# EAGLE design avr_board (EAGLE 9.6.2)
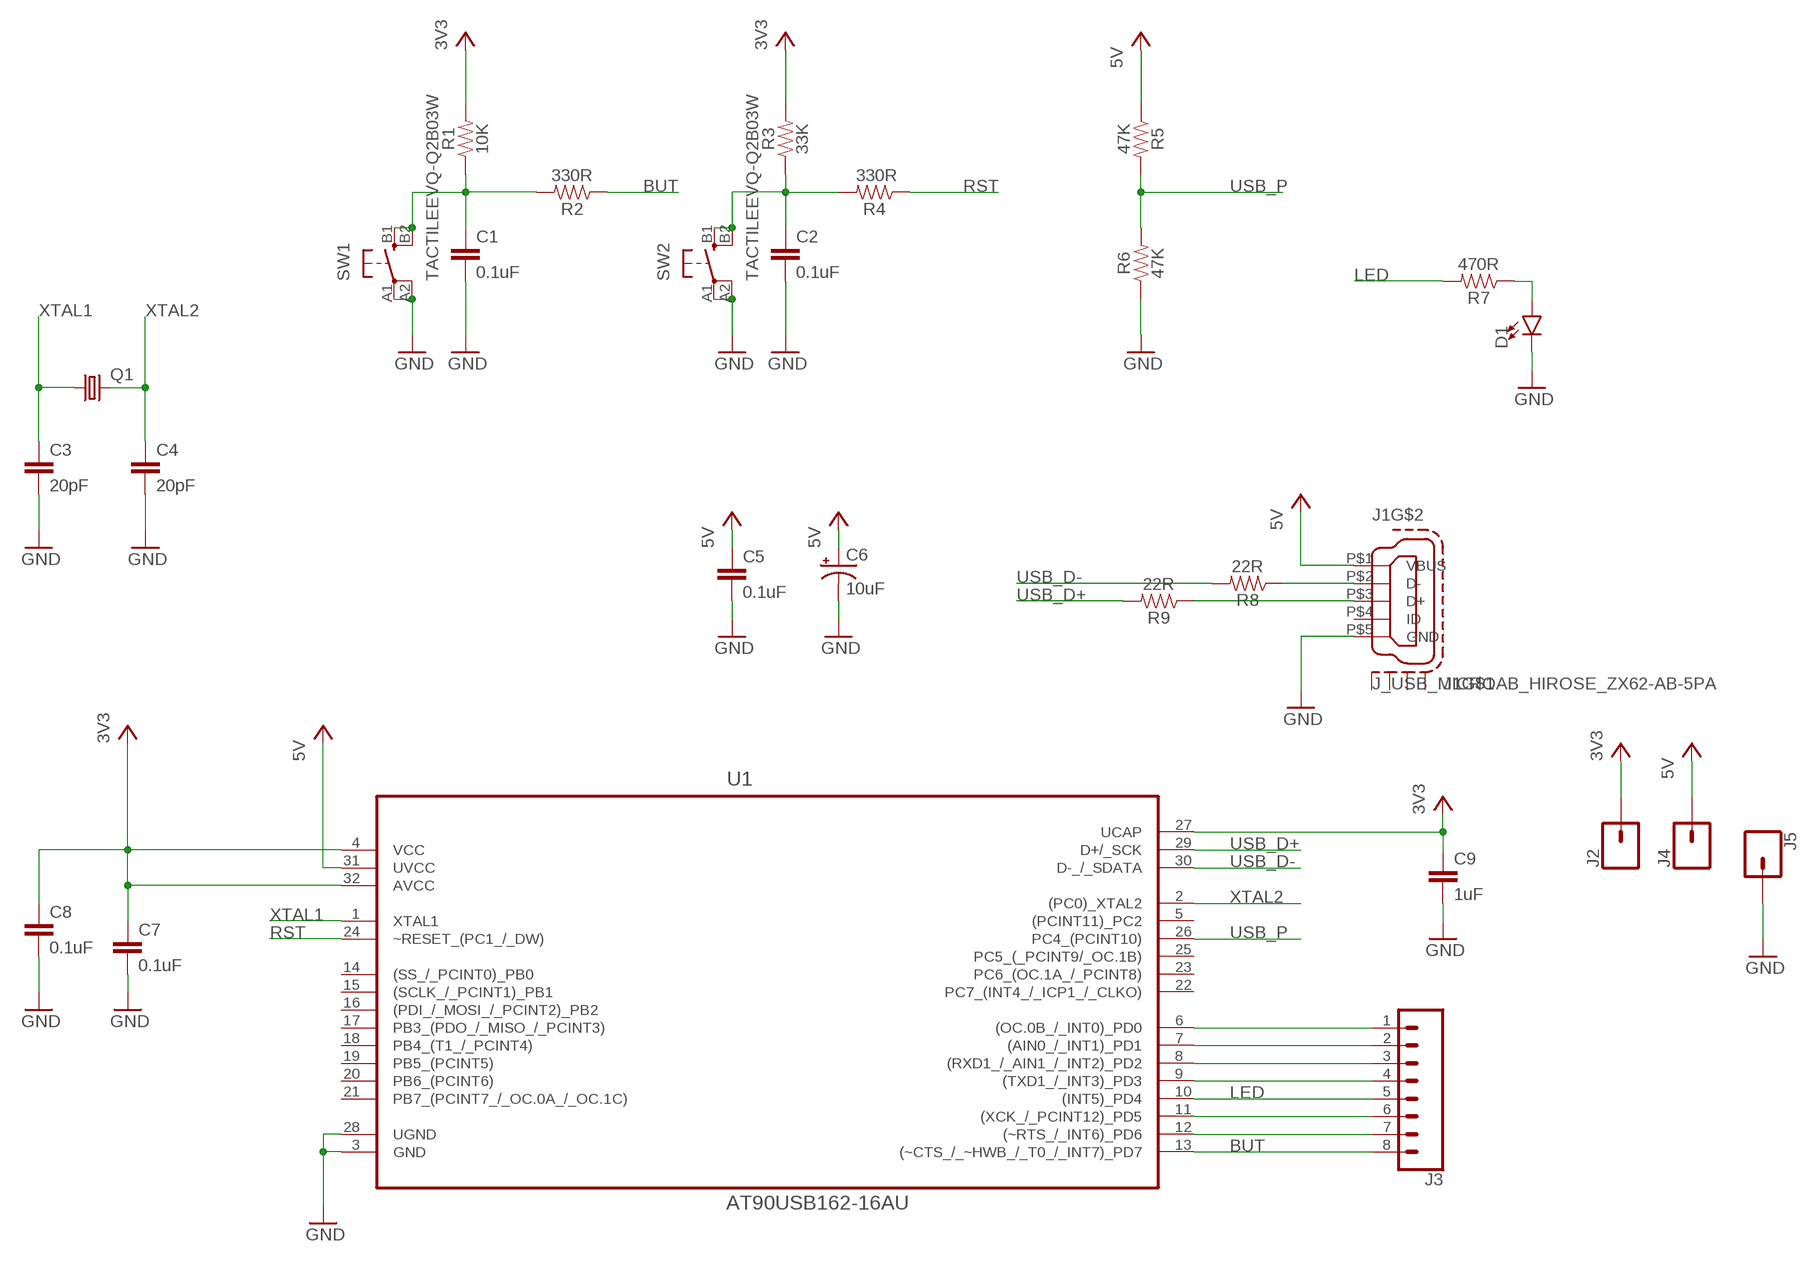
[diagram p0: schematic, sheet 1]

## Parts
C1  0.1uF  0.1UF-0603-25V-(+80/-20%)  [0603]
C2  0.1uF  0.1UF-0603-25V-(+80/-20%)  [0603]
C3  20pF  0.1UF-0603-25V-(+80/-20%)  [0603]
C4  20pF  0.1UF-0603-25V-(+80/-20%)  [0603]
C5  0.1uF  0.1UF-0603-25V-(+80/-20%)  [0603]
C6  10uF  10UF-TANT  [EIA3216]
C7  0.1uF  0.1UF-0603-25V-(+80/-20%)  [0603]
C8  0.1uF  0.1UF-0603-25V-(+80/-20%)  [0603]
C9  1uF  0.1UF-0603-25V-(+80/-20%)  [0603]
D1  LEDPLCC  [PLCC-2]
J1  J_USB_MICROAB_HIROSE_ZX62-AB-5PA  [J_USB_MICROAB_HIROSE_ZX62-AB-5PA]
J2  CONN_01  [1X01]
J3  CONN_08"  [1X08]
J4  CONN_01  [1X01]
J5  CONN_01  [1X01]
Q1  CRYSTALCTS406  [CTS406]
R1  10K  RESISTOR0603  [0603]
R2  330R  RESISTOR0603  [0603]
R3  33K  RESISTOR0603  [0603]
R4  330R  RESISTOR0603  [0603]
R5  47K  RESISTOR0603  [0603]
R6  47K  RESISTOR0603  [0603]
R7  470R  RESISTOR0603  [0603]
R8  22R  RESISTOR0603  [0603]
R9  22R  RESISTOR0603  [0603]
SW1  TACTILEEVQ-Q2B03W  [TACTILE_PAC]
SW2  TACTILEEVQ-Q2B03W  [TACTILE_PAC]
U1  AT90USB162-16AU  [QFP80P900X900X120-32N]

## Nets
+5V: C5.1 C6.A(+) J1.P$1(VBUS) J4.1 R5.1 U1.31(UVCC) ; supply symbol labelled 5V
BUT: J3.8 R2.1 U1.13((~CTS_/_~HWB_/_T0_/_INT7)_PD7)
GND: C1.2 C2.2 C3.2 C4.2 C5.2 C6.C(-) C7.2 C8.2 C9.2 D1.C J1.P$5(GND) J5.1 R6.1 SW1.A1 SW1.A2 SW2.A1 SW2.A2 U1.3(GND) U1.28(UGND)
LED: J3.5 R7.2 U1.10((INT5)_PD4)
N$1: C1.1 R1.1 R2.2 SW1.B1 SW1.B2
N$2: D1.A R7.1
N$3: C2.1 R3.1 R4.2 SW2.B1 SW2.B2
N$4: J3.7 U1.12((~RTS_/_INT6)_PD6)
N$5: J1.P$2(D-) R8.1
N$6: J1.P$3(D+) R9.1
N$7: J3.6 U1.11((XCK_/_PCINT12)_PD5)
N$9: J3.4 U1.9((TXD1_/_INT3)_PD3)
N$10: J3.3 U1.8((RXD1_/_AIN1_/_INT2)_PD2)
N$11: J3.2 U1.7((AIN0_/_INT1)_PD1)
N$12: J3.1 U1.6((OC.0B_/_INT0)_PD0)
RST: R4.1 U1.24(~RESET_(PC1_/_DW))
USB_D+: R9.2 U1.29(D+/_SCK)
USB_D-: R8.2 U1.30(D-_/_SDATA)
USB_P: R5.2 R6.2 U1.26(PC4_(PCINT10))
VCC: C7.1 C8.1 C9.1 J2.1 R1.2 R3.2 U1.4(VCC) U1.27(UCAP) U1.32(AVCC) ; supply symbol labelled 3V3
XTAL1: C3.1 Q1.1 U1.1(XTAL1)
XTAL2: C4.1 Q1.3 U1.2((PC0)_XTAL2)
Unconnected: J1.P$4(ID) J1.SHIELD1(S1) J1.SHIELD2(S2) J1.SHIELD3(S3) J1.SHIELD4(S4) U1.5((PCINT11)_PC2) U1.14((SS_/_PCINT0)_PB0) U1.15((SCLK_/_PCINT1)_PB1) U1.16((PDI_/_MOSI_/_PCINT2)_PB2) U1.17(PB3_(PDO_/_MISO_/_PCINT3)) U1.18(PB4_(T1_/_PCINT4)) U1.19(PB5_(PCINT5)) U1.20(PB6_(PCINT6)) U1.21(PB7_(PCINT7_/_OC.0A_/_OC.1C)) U1.22(PC7_(INT4_/_ICP1_/_CLKO)) U1.23(PC6_(OC.1A_/_PCINT8)) U1.25(PC5_(_PCINT9/_OC.1B))

## Library data of the parts
C1 C2 C5 C7 C8 = SparkFun-Capacitors:0.1UF: 0.1µF ceramic capacitors A capacitor is a passive two-terminal electrical component used to store electrical energy temporarily in an electric field.; PROD_ID: CAP-00810
C3 C4 C9 = SparkFun-Capacitors:0.1UF: 0.1µF ceramic capacitors A capacitor is a passive two-terminal electrical component used to store electrical energy temporarily in an electric field.; PROD_ID: CAP-00810; VALUE: 0.1uF
C6 = SparkFun-Retired:10UF-TANT: 10uF Tantalum SMT CAP-00811- 16V 10% (EIA-3216); PROD_ID: CAP-00811
D1 = SparkFun-LED:LED: LED (Generic) Standard schematic elements and footprints for 5mm, 3mm, 1206, and 0603 sized LEDs. Generic LEDs with no color specified.
J1 = j_usb_hirose_zx62-ab-5pa:J_USB_MICROAB_HIROSE_ZX62-AB-5PA: USB Micro-AB SMT connector Hirose Electric Co Ltd: ZX62-AB-5P
J2 J4 J5 = SparkFun-Connectors:CONN_01: Single connection point. Often used as Generic Header-pin footprint for 0.1 inch spaced/style header connections On any of the 0.1 inch spaced packages, you can populate with these: Break Away Headers - Straight <https://www.sparkfun.com/products/116> (PRT-00116) Break Away Male Headers - Right Angle <https://www.sparkfun.com/products/553> (PRT-00553) Female Headers <https://www.sparkfun.com/products/115> (PRT-00115) Break Away Headers - Machine Pin <https://www.sparkfun.com/products/117> (PRT-00117) Break Away Female Headers - Swiss Machine Pin <https://www.sparkfun.com/products/743> (PRT-00743) This device is also useful as a general connection point to wire up your design to another part of your project. Our various solder wires solder well into these plated through hole pads. Hook-Up Wire - Assortment (Stranded, 22 AWG) <https://www.sparkfun.com/products/11375> (PRT-11375) Hook-Up Wire - Assortment (Solid Core, 22 AWG) <https://www.sparkfun.com/products/11367> (PRT-11367) View the entire wire category on our website here <https://www.sparkfun.com/categories/141> Special notes: SMTSO-256-ET is a "flush mount" nut for a 4-40 screw. We mostly use this on specialty testbeds; it is a nice way to connect hardware to your PCB at an adjustable hieght. Also note, the SNAP packages are for using a snappable style connector. We sell a baggie of snaps and they are also used on two LilyPad designs: Snap Assortment - 30 pack (male and female) <https://www.sparkfun.com/products/11347> (DEV-11347) LilyPad Arduino SimpleSnap <https://www.sparkfun.com/products/10941> (DEV-10941) LilyPad SimpleSnap Protoboard <https://www.sparkfun.com/products/10940> (DEV-10940)
J3 = SparkFun-Connectors:CONN_08: Multi connection point. Often used as Generic Header-pin footprint for 0.1 inch spaced/style header connections On any of the 0.1 inch spaced packages, you can populate with these: Break Away Headers - Straight <https://www.sparkfun.com/products/116> (PRT-00116) Break Away Male Headers - Right Angle <https://www.sparkfun.com/products/553> (PRT-00553) Female Headers <https://www.sparkfun.com/products/115> (PRT-00115) Break Away Headers - Machine Pin <https://www.sparkfun.com/products/117> (PRT-00117) Break Away Female Headers - Swiss Machine Pin <https://www.sparkfun.com/products/743> (PRT-00743) Arduino Stackable Header - 8 Pin <https://www.sparkfun.com/products/9279> (PRT-09279) For SCREWTERMINALS and SPRING TERMINALS visit here: Screw Terimnals on SparkFun.com <https://www.sparkfun.com/search/results?term=Screw+Terminals> (5mm/3.5mm/2.54mm spacing) This device is also useful as a general connection point to wire up your design to another part of your project. Our various solder wires solder well into these plated through hole pads. Hook-Up Wire - Assortment (Stranded, 22 AWG) <https://www.sparkfun.com/products/11375> (PRT-11375) Hook-Up Wire - Assortment (Solid Core, 22 AWG) <https://www.sparkfun.com/products/11367> (PRT-11367) View the entire wire category on our website here <https://www.sparkfun.com/categories/141> Special notes: Molex polarized connector foot print use with SKU : PRT-08231 with associated crimp pins and housings. 1MM SMD Version SKU: PRT-10208 NOTES ON THE VARIANTS LOCK and LOCK_LONGPADS... This footprint was designed to help hold the alignment of a through-hole component (i.e. 6-pin header) while soldering it into place. You may notice that each hole has been shifted either up or down by 0.005 of an inch from it's more standard position (which is a perfectly straight line). This slight alteration caused the pins (the squares in the middle) to touch the edges of the holes. Because they are alternating, it causes a "brace" to hold the component in place. 0.005 has proven to be the perfect amount of "off-center" position when using our standard breakaway headers. Although looks a little odd when you look at the bare footprint, once you have a header in there, the alteration is very hard to notice. Also,if you push a header all the way into place, it is covered up entirely on the bottom side.; PROD_ID: CONN-08438
Q1 = crystal:CRYSTAL: CRYSTAL; OC_FARNELL: unknown; OC_NEWARK: unknown
R1-R9 = SparkFun-Resistors:RESISTOR: Generic Resistor Package
SW1 SW2 = alex:TACTILE
U1 = AT90USB162-16AU:AT90USB162-16AU: 8-bit Microcontroller; AVAILABILITY: Unavailable; DESCRIPTION: AT90 Series 16 MHz 16 KB Flash 512 B SRAM 8-Bit Microcontroller - TQFP-32; MF: Microchip; MP: AT90USB162-16AU; PACKAGE: TQFP-32 Microchip; PRICE: None

## Board
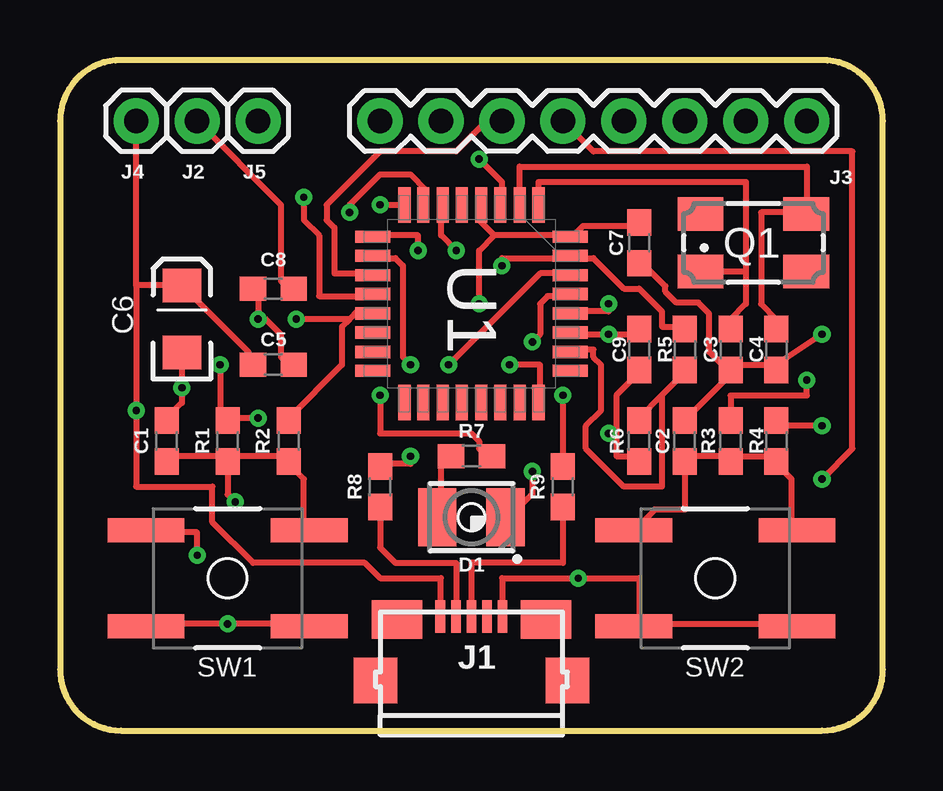
[diagram p1: board, top side]
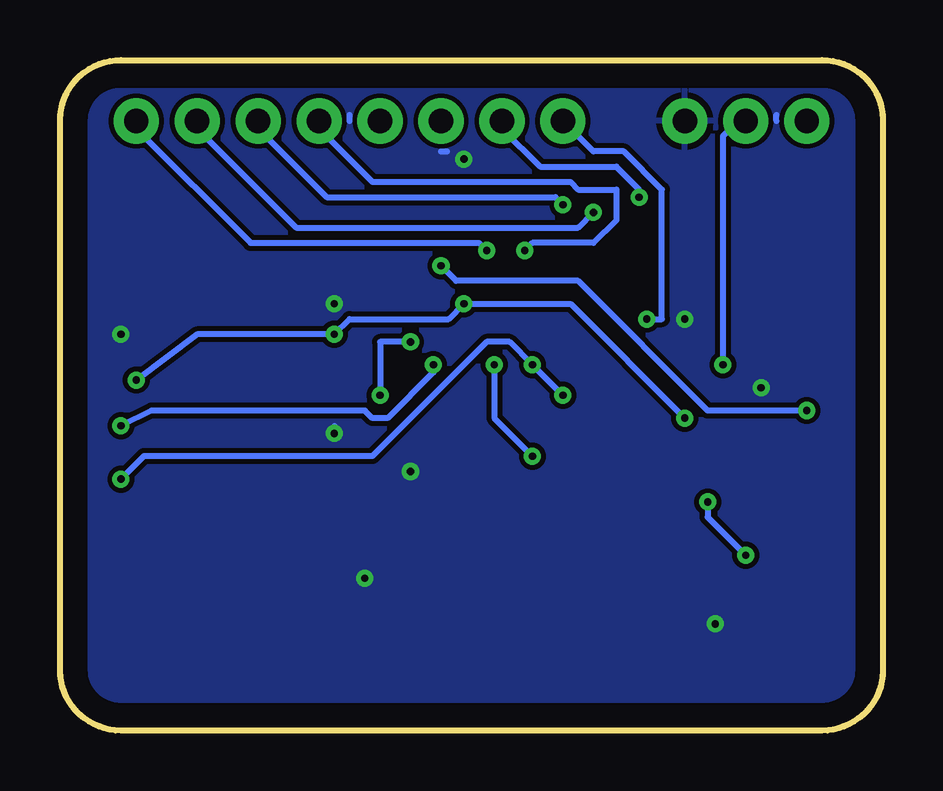
[diagram p2: board, bottom side, seen from below]

Size 34.29 x 27.94 mm. Coordinates in mm from the lower left corner, seen from the top.
Outline: 2.54,0 31.75,0 arc90 34.29,2.54 34.29,25.4 arc90 31.75,27.94 2.54,27.94 arc90 0,25.4 0,2.54 arc90 2.54,0
Copper layers (1*16): Top 0.035mm / dielectric 1.5mm / Bottom 0.035mm
Design rules "default *": minimum track width 10mil, minimum drill 24mil, track to track 8mil, track to pad 8mil, pad to pad 8mil, via to via 8mil, smd to smd 8mil, copper to edge 40mil, drill to drill 8mil, minimum pad ring 10mil, minimum via ring 8mil, stop-mask expansion 4mil, vias tented up to drill 20mil, thermal gap 10mil

### Footprints (pad centres in the part's own frame; a part is rotated, then mirrored left to right if it is on the bottom)
0603 = smd 1.1 x 1: 1 -0.85,0; 2 0.85,0
EIA3216 = smd 1.4 x 1.6: A 1.4,0; C -1.4,0
PLCC-2 = smd 1.6 x 2.4: A 1.425,0; C -1.425,0
J_USB_MICROAB_HIROSE_ZX62-AB-5PA = smd 0.4 x 1.35: P$1 -1.3,4.125; P$2 -0.65,4.125; P$3 0,4.125; P$4 0.65,4.125; P$5 1.3,4.125 | smd 1.8 x 1.9: SHIELD1 -4,1.45; SHIELD4 4,1.45 | smd 2.1 x 1.6: SHIELD2 -3.1,4; SHIELD3 3.1,4
1X01 = drill 1.016 pad 1.88: 1 0,0
1X08 = drill 1.016 pad 1.88: 1 0,0; 2 2.54,0; 3 5.08,0; 4 7.62,0; 5 10.16,0; 6 12.7,0; 7 15.24,0; 8 17.78,0
CTS406 = smd 1.9 x 1.4: 1 -2.2,-1.2; 2 2.2,-1.2; 3 2.2,1.2; 4 -2.2,1.2
TACTILE_PAC = smd 3.2 x 1: A1 -3.4,-2; A2 3.4,-2; B1 -3.4,2; B2 3.4,2
QFP80P900X900X120-32N = smd 1.473 x 0.508: 1 -4.115,2.794; 2 -4.115,2.007; 3 -4.115,1.194; 4 -4.115,0.406; 5 -4.115,-0.406; 6 -4.115,-1.194; 7 -4.115,-2.007; 8 -4.115,-2.794; 17 4.115,-2.794; 18 4.115,-2.007; 19 4.115,-1.194; 20 4.115,-0.406; 21 4.115,0.406; 22 4.115,1.194; 23 4.115,2.007; 24 4.115,2.794 | smd 0.508 x 1.473: 9 -2.794,-4.115; 10 -2.007,-4.115; 11 -1.194,-4.115; 12 -0.406,-4.115; 13 0.406,-4.115; 14 1.194,-4.115; 15 2.007,-4.115; 16 2.794,-4.115; 25 2.794,4.115; 26 2.007,4.115; 27 1.194,4.115; 28 0.406,4.115; 29 -0.406,4.115; 30 -1.194,4.115; 31 -2.007,4.115; 32 -2.794,4.115

### Placement (x,y rotation side)
C1  4.45,12.06 90 top
C2  26.04,12.06 90 top
C3  27.94,15.88 270 top
C4  29.84,15.88 270 top
C5  8.89,15.24 0 top
C6  5.08,17.14 90 top
C7  24.13,20.32 270 top
C8  8.89,18.41 180 top
C9  24.13,15.88 270 top
D1  17.14,8.89 180 top
J1  17.14,0.64 0 top
J2  5.71,25.4 0 top
J3  31.11,25.4 180 top
J4  3.17,25.4 0 top
J5  8.26,25.4 0 top
Q1  28.89,20.32 0 top
R1  6.99,12.06 90 top
R2  9.53,12.06 270 top
R3  27.94,12.06 90 top
R4  29.84,12.06 270 top
R5  26.04,15.88 270 top
R6  24.13,12.06 90 top
R7  17.14,11.43 0 top
R8  13.34,10.16 90 top
R9  20.95,10.16 90 top
SW1  6.99,6.35 0 top
SW2  27.3,6.35 0 top
U1  17.14,17.78 270 top

### Tracks (layer width: path | path; a pad name or v marks a point on that pad's centre or on a via)
+5V  (via drill 0.3)
  Top 0.254: 3.17,18.55 C6.A 5.11,18.52 7.85,15.77 7.85,15.32 C5.1 | J1.P$1 15.85,6.32 15.88,6.35 13.34,6.35 12.7,6.99 8.04,6.99 6.35,8.68 6.35,10.16 3.17,10.16 v3.17,13.34 3.17,18.55 | R5.1 26.04,16.83 25.08,16.83 25.08,17.46 24.13,18.41 23.5,18.41 22.23,19.68 21.27,19.68 U1.31 20.95,19.68 18.41,19.68 v18.41,19.37 | 3.17,18.55 J4.1
  Bottom 0.254: v18.41,19.37 17.78,18.73 12.7,18.73 7.3,13.34 v3.17,13.34
BUT  (via drill 0.3)
  Top 0.254: 12.06,17.14 12.38,17.46 13.02,17.46 U1.13 | 12.06,17.14 11.75,16.83 11.75,15.24 9.53,13.02 R2.1 | 12.06,17.14 v9.84,17.14
  Bottom 0.254: J3.8 12.06,24.13 10.79,24.13 9.21,22.54 9.21,17.14 v9.84,17.14
GND  (via drill 0.3)
  Top 0.254: J1.P$5 18.45,6.32 18.41,6.35 v21.59,6.35 24.13,6.35 24.13,4.45 | 23.86,4.4 SW2.A1 24.13,4.45 | 29.84,15.24 27.94,15.24 C3.2 | SW1.A1 3.81,4.45 v6.99,4.45 10.16,4.45 SW1.A2 | 24.13,4.45 30.18,4.45 | 30.18,4.45 30.48,4.45 | 30.25,4.45 30.47,4.35 SW2.A2 30.18,4.52 30.18,4.45 | 8.57,17.14 8.26,17.46 8.26,18.41 C8.2 | 8.57,17.14 9.21,16.51 9.21,15.56 9.53,15.24 C5.2 | C6.C v5.08,14.29 5.08,13.65 4.45,13.02 C1.2 | 23.18,12.38 23.18,13.97 24.13,14.92 C9.2 | 23.18,12.38 23.18,11.43 24.13,11.43 R6.1 | v17.46,23.81 18.41,22.86 18.41,21.91 U1.3 | v22.86,17.78 22.86,17.46 21.27,17.46 U1.28 | v19.68,10.79 19.68,9.84 18.73,8.89 D1.C | v22.86,12.38 23.18,12.38 | v8.26,17.14 8.57,17.14 | v31.75,16.51 29.84,15.24 | 29.84,15.24 C4.2 | C2.2 26.14,13.03 27.96,14.86 C3.2 | C7.2 24.31,19.43 25.22,18.52 25.22,18.29 25.68,17.83 26.59,17.83 27.05,17.37 27.05,15.77 27.74,15.09 C3.2
  Bottom 0.254: 22.86,12.7 v22.86,12.38 | 22.23,25.4 22.23,25.65 | 18.41,24.13 18.16,24.13 | 4.45,25.4 4.45,25.65
  pour Bottom: -0.64,28.57 -0.64,-0.64 35.56,-0.64 35.56,28.57
LED  (via drill 0.3)
  Top 0.254: v13.34,13.97 13.34,12.38 17.14,12.38 17.46,12.06 17.46,11.75 17.78,11.43 R7.2 | v14.61,15.24 14.29,15.56 14.29,19.37 13.97,19.68 13.34,19.68 U1.10 | J3.5 22.23,24.13 33.02,24.13 33.02,11.75 v31.75,10.48
  Bottom 0.254: v13.34,13.97 v14.61,15.24 15.56,16.19 16.51,16.19 21.27,11.43 30.8,11.43 v31.75,10.48
N$1  (via drill 0.3)
  Top 0.254: 6.99,11.43 4.45,11.43 C1.1 | SW1.B2 10.16,8.57 10.16,10.48 9.53,11.11 R2.2 9.53,11.43 6.99,11.43 | 6.99,11.43 R1.1 6.99,9.84 v7.3,9.53 | SW1.B1 3.68,8.26 5.71,8.26 v5.71,7.3
  Bottom 0.254: v7.3,9.53 7.3,8.89 v5.71,7.3
N$2
  Top 0.254: R7.1 16.19,11.43 15.88,11.11 15.88,8.89 D1.A
N$3
  Top 0.254: 27.94,11.43 26.04,11.43 C2.1 26.04,9.21 24.77,9.21 SW2.B1 | 27.94,11.43 29.84,11.43 R4.2 29.84,11.11 30.48,10.48 30.48,8.57 SW2.B2 | 27.94,11.43 R3.1
N$4  (via drill 0.3)
  Top 0.254: v10.16,22.23 10.16,21.27 10.79,20.64 10.79,18.1 13.02,18.1 U1.12
  Bottom 0.254: v10.16,22.23 10.16,22.54 11.11,23.5 14.29,23.5 15.88,25.08 J3.7
N$5
  Top 0.254: J1.P$2 16.51,4.78 16.51,6.99 13.97,6.99 13.34,7.62 R8.1
N$6
  Top 0.254: R9.1 20.95,6.99 17.14,6.99 J1.P$3
N$7
  Top 0.254: J3.6 17.78,25.4 16.51,24.13 13.34,24.13 11.11,21.91 11.11,21.27 11.43,20.95 11.43,19.05 13.02,19.05 U1.11
N$9  (via drill 0.3)
  Top 0.254: v14.92,20 14.92,20.64 13.34,20.64 U1.9
  Bottom 0.254: v14.92,20 14.61,20.32 12.06,20.32 11.11,21.27 11.11,22.54 12.7,22.54 13.02,22.86 21.27,22.86 23.5,25.08 J3.4
N$10  (via drill 0.3)
  Top 0.254: v13.34,21.91 14.29,21.91 U1.8
  Bottom 0.254: v13.34,21.91 13.65,22.23 23.18,22.23 26.04,25.08 J3.3
N$11  (via drill 0.3)
  Top 0.254: v12.06,21.59 12.06,21.91 13.34,23.18 14.61,23.18 15.24,22.54 15.24,21.91 U1.7
  Bottom 0.254: v12.06,21.59 12.7,20.95 24.45,20.95 28.57,25.08 J3.2
N$12  (via drill 0.3)
  Top 0.254: v16.51,20 15.88,20.64 15.88,21.59 U1.6
  Bottom 0.254: v16.51,20 16.83,20.32 26.35,20.32 31.11,25.08 J3.1
RST  (via drill 0.3)
  Top 0.254: v31.75,12.7 29.84,12.7 R4.1 | v18.73,15.24 20,15.24 20,13.97 U1.24
  Bottom 0.254: v31.75,12.7 30.48,13.34 21.59,13.34 21.27,13.02 20.64,13.02 18.73,14.92 v18.73,15.24
USB_D+  (via drill 0.3)
  Top 0.254: v20.95,13.97 R9.2 | v19.68,16.19 20,16.51 20,17.78 20.32,18.1 20.95,18.1 U1.29
  Bottom 0.254: v20.95,13.97 20.95,16.19 v19.68,16.19
USB_D-  (via drill 0.3)
  Top 0.254: v14.61,11.43 14.61,11.11 13.34,11.11 R8.2 | v16.19,15.24 20,19.05 20.95,19.05 U1.30
  Bottom 0.254: v14.61,11.43 16.19,13.02 v16.19,15.24
USB_P
  Top 0.254: 25.08,13.97 26.04,14.92 R5.2 | 25.08,13.97 24.13,13.02 R6.2 | 25.08,13.97 25.08,10.16 23.5,10.16 21.91,11.75 21.91,12.7 22.54,13.34 22.54,15.24 22.23,15.56 22.23,15.88 21.27,15.88 U1.26
VCC  (via drill 0.3)
  Top 0.254: 6.99,13.02 6.67,13.34 v6.67,15.24 | J2.1 9.21,21.91 9.21,18.73 9.53,18.41 C8.1 | 18.1,20.64 17.46,21.27 17.46,21.59 U1.4 | 18.1,20.64 20.95,20.64 U1.32 21.34,20.57 21.79,21.03 24.08,21.03 C7.1 | C9.1 24.13,16.51 v22.86,16.51 21.27,16.51 U1.27 | 27.94,13.02 R3.2 27.94,13.97 31.11,13.97 v31.11,14.61 | 18.1,20.64 17.46,20 v17.46,17.78 | v8.26,13.02 6.99,13.02 | 6.99,13.02 R1.2
  Bottom 0.254: v6.67,15.24 6.67,24.77 6.03,25.4 J2.1 | v31.11,14.61 28.57,16.51 v22.86,16.51 22.23,17.14 18.1,17.14 v17.46,17.78 13.02,17.78 v8.26,13.02
XTAL1
  Top 0.254: U1.1 19.94,22.86 28.57,22.86 28.57,19.12 | 28.57,19.12 Q1.1 | 28.57,19.12 28.57,17.78 27.94,17.14 C3.1
XTAL2
  Top 0.254: U1.2 19.15,23.5 31.11,23.5 31.11,21.52 Q1.3 31.09,21.59 29.21,21.59 29.21,17.78 29.84,17.14 C4.1

### Text on the board
Document: 5V | 3V | 0V | PD7 | PD0 | BUT | RST